# Altium schematic sheet Game_Consol_Top.SchDoc: Game Console Schematic
size A4; CompanyName: University of Melbourne; DrawnBy: 740959; Engineer: Qingyuan Yang; Organization: University of Melbourne; DocumentNumber: 1; Revision: 0.1; SheetNumber: 1; SheetTotal: 10; Title_Project: Game Console
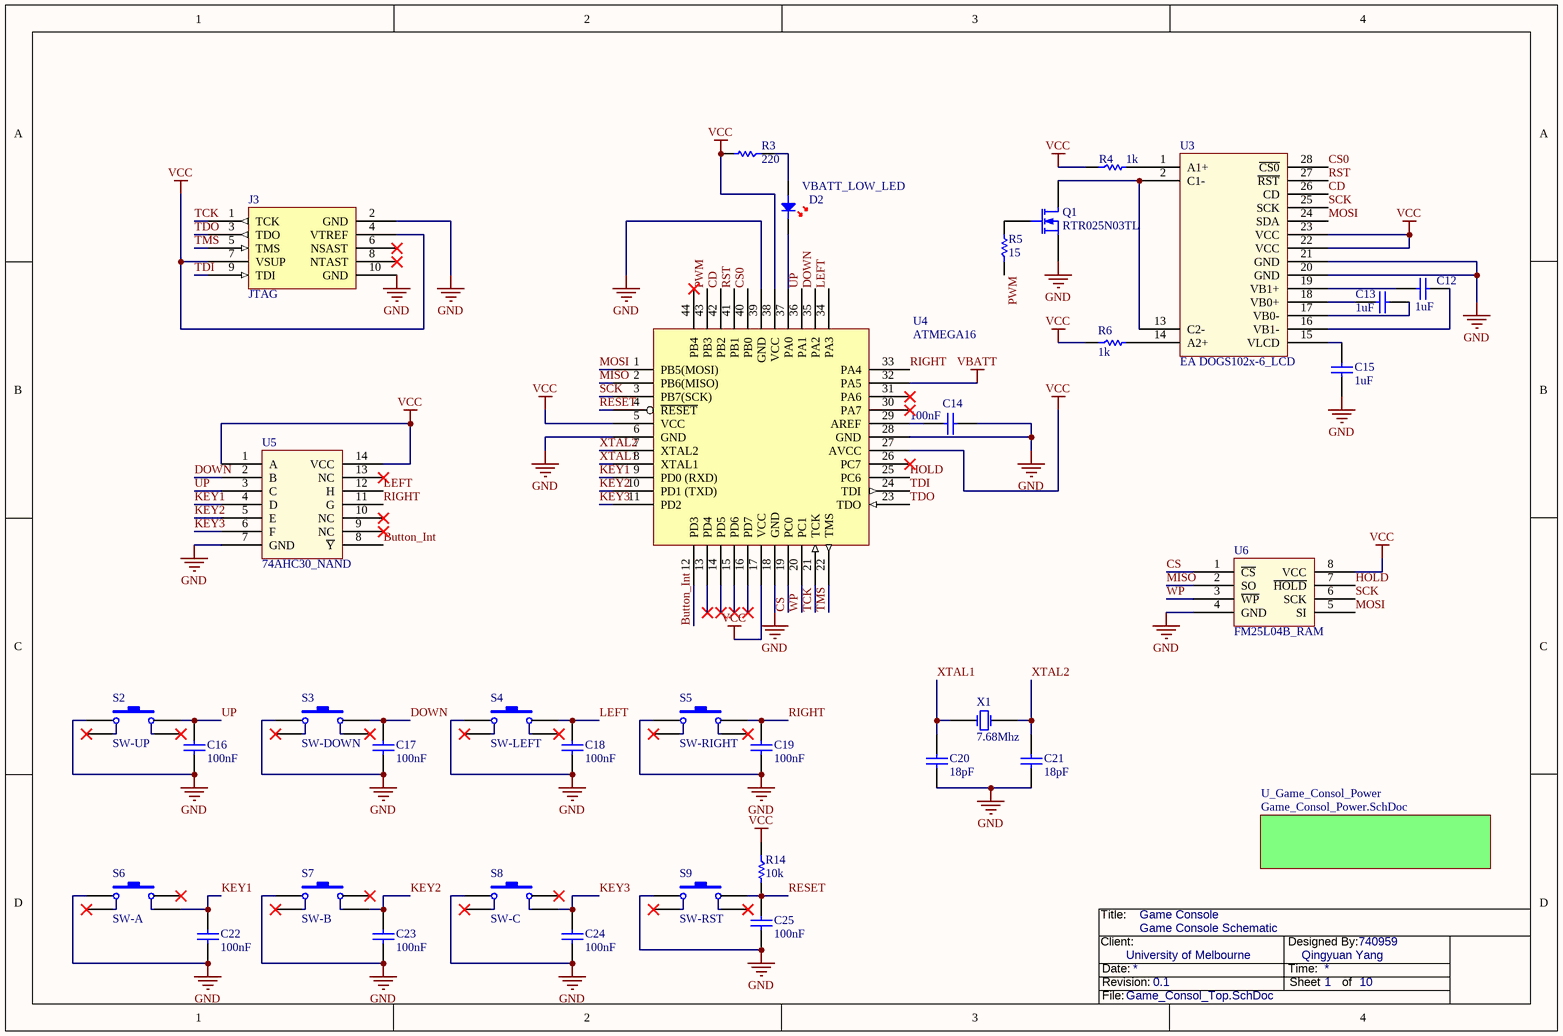
[diagram p0: Game_Consol_Top.SchDoc]

## Parts
C12  1uF  [0805]
C13  1uF  [0805]
C14  100nF  [0805]
C15  1uF  [0805]
C16  100nF  [0805]
C17  100nF  [0805]
C18  100nF  [0805]
C19  100nF  [0805]
C20  18pF  [0805]
C21  18pF  [0805]
C22  100nF  [0805]
C23  100nF  [0805]
C24  100nF  [0805]
C25  100nF  [0805]
D2  VBATT_LOW_LED  [0805D]
J3  JTAG  [BOXEDVERT10]
Q1  RTR025N03TL  [SOT23]
R3  220  [0805]
R4  1k  [0805]
R5  15  [0805]
R6  1k  [0805]
R14  10k  [0805]
S2  SW-UP  [SPNO_SMD]
S3  SW-DOWN  [SPNO_SMD]
S4  SW-LEFT  [SPNO_SMD]
S5  SW-RIGHT  [SPNO_SMD]
S6  SW-A  [SPNO_SMD]
S7  SW-B  [SPNO_SMD]
S8  SW-C  [SPNO_SMD]
S9  SW-RST  [SPNO_SMD]
U3  EA DOGS102x-6_LCD  [EA DOGS102x]
U4  ATMEGA16  [QFP-48]
U5  74AHC30_NAND  [SOIC-14]
U6  FM25L04B_RAM  [SOIC-8]
X1  7.68Mhz  [XTAL_FLAT_SMD]

## Sub-sheets
U_Game_Consol_Power = Game_Consol_Power.SchDoc: no entries

## Nets
GND: C14.1 C15.2 C16.2 C17.2 C18.2 C19.2 C20.2 C21.2 C22.2 C23.2 C24.2 C25.2 J3.2(GND) J3.10(GND) Q1.2 S2.1 S3.1 S4.1 S5.1 S6.1 S7.1 S8.1 S9.1 U3.20(GND) U3.21(GND) U4.6(GND) U4.18(GND) U4.28(GND) U4.39(GND) U5.7(GND) U6.4(GND)
VBATT: U4.32(PA5)
VCC: J3.4(VTREF) J3.7(VSUP) R3.2 R4.1 R6.1 R14.1 U3.22(VCC) U3.23(VCC) U4.5(VCC) U4.17(VCC) U4.27(AVCC) U4.38(VCC) U5.1(A) U5.14(VCC) U6.8(VCC)
Button_Int: U4.12(PD3) U5.8(~{Y})
CD: U3.26(CD) U4.42(PB2)
CS: U4.19(PC0) U6.1(~{CS})
CS0: U3.28(~{CS0}) U4.40(PB0)
DOWN: C17.1 S3.3 U4.35(PA2) U5.2(B)
HOLD: U4.25(PC6) U6.7(~{HOLD})
KEY1: C22.1 S6.4 U4.9(PD0_(RXD)) U5.4(D)
KEY2: C23.1 S7.4 U4.10(PD1_(TXD)) U5.5(E)
KEY3: C24.1 S8.4 U4.11(PD2) U5.6(F)
LEFT: C18.1 S4.3 U4.34(PA3) U5.12(H)
MISO: U4.2(PB6(MISO)) U6.2(SO)
MOSI: U3.24(SDA) U4.1(PB5(MOSI)) U6.5(SI)
PWM: R5.1 U4.43(PB3)
RESET: C25.1 R14.2 S9.3 U4.4(~{RESET})
RIGHT: C19.1 S5.3 U4.33(PA4) U5.11(G)
RST: U3.27(~{RST}) U4.41(PB1)
SCK: U3.25(SCK) U4.3(PB7(SCK)) U6.6(SCK)
TCK: J3.1(TCK) U4.21(TCK)
TDI: J3.9(TDI) U4.24(TDI)
TDO: J3.3(TDO) U4.23(TDO)
TMS: J3.5(TMS) U4.22(TMS)
UP: C16.1 S2.3 U4.36(PA1) U5.3(C)
WP: U4.20(PC1) U6.3(~{WP})
XTAL1: C20.1 U4.8(XTAL1) X1.1(OSC1)
XTAL2: C21.1 U4.7(XTAL2) X1.2(OSC2)
NetC12_1: C12.1 U3.16(VB1-)
NetC12_2: C12.2 U3.19(VB1+)
NetC13_1: C13.1 U3.17(VB0-)
NetC13_2: C13.2 U3.18(VB0+)
NetC14_2: C14.2 U4.29(AREF)
NetC15_1: C15.1 U3.15(VLCD)
NetD2_A: D2.A R3.1
NetD2_K: D2.K U4.37(PA0)
NetQ1_1: Q1.1 R5.2
NetQ1_3: Q1.3 U3.2(C1-) U3.13(C2-)
NetR4_2: R4.2 U3.1(A1+)
NetR6_2: R6.2 U3.14(A2+)

Not connected (* = marked no-connect by the designer): J3 6(NSAST)* 8(NTAST)*; S2 2* 4*; S3 2* 4*; S4 2* 4*; S5 2* 4*; S6 2* 3*; S7 2* 3*; S8 2* 3*; S9 2* 4*; U3 3 4 5 6 7 8 9 10 11 12; U4 13(PD4)* 14(PD5)* 15(PD6)* 16(PD7)* 26(PC7)* 30(PA7)* 31(PA6)* 44(PB4)*; U5 9(NC)* 10(NC)* 13(NC)*

## Notes on the sheet
- Title:
- Client:
- Date:
- Revision:
- Time:
- Designed By:
- Sheet
- of
- File:

## Library data of the parts
C12-C25 = C 0805: Capacitor 100nF; Class I: Passive; Revision: July-2002: Re-released for DXP Platform.
  C12 C13 C15: Value: 1uF
  C14 C16-C19 C22-C25: Value: 100nF
  C20 C21: Value: 18pF
D2 = LED RED: Light Emitting Diode; Manufacturer: Generic Components; Class I: Discrete; Class II: Diode - Switching; Published: 8-Jun-2000; Revision: July-2002: Re-released for DXP Platform.; Publisher: Altium Limited
J3 = JTAG_CON: JTAG ATMEL connector
Q1 = MOSFET-N: N-Channel MOSFET; PackageDocument: 1995/1996; Published: 8-Jun-2000; LatestRevisionDate: 17-Jul-2002; LatestRevisionNote: Re-released for DXP Platform.; PackageReference: E3; Publisher: Altium Limited
R3-R6 R14 = R: Resistor
  R3: Value: 220
  R4 R6: Value: 1k
  R5: Value: 15
  R14: Value: 10k
S2-S9 = SW-PB: Push Button Switch; Manufacturer: TE Connectivity; Manufacturer Part Number: FSM4JSMA; Circuit: SPST-NO; Switch Function: Off-Mom; Contact Rating @ Voltage: 0.05A @ 12VDC; Actuator Type: Standard; Actuator Orientation: Top Actuated; Outline: 6.00mm x 6.00mm; Illumination: Non-Illuminated; Operating Force: 160gf; Published: 24-Mar-1999; LatestRevisionDate: 17-Jul-2002; LatestRevisionNote: Re-released for DXP Platform.; PackageReference: SPST-2; Publisher: Altium Limited; PackageDescription: Switch; 2 Leads; Supplier 1: Digi-Key; RoHS: RoHS Compliant; Category: Switches; Stock 1: 30338; Pricing 1: 1=0.28, 10=0.265, 25=0.2256, 50=0.1974, 100=0.1834, 250=0.1622, 500=0.15516, 1000=0.12694, 5000=0.10579 (AUD); Mounting Type: Surface Mount; Termination Style: Gull Wing; Packaging: Bulk; ComponentLink1URL: http://documents.tycoelectronics.com/commerce/DocumentDelivery/DDEController?Action=srchrtrv&DocNm=2-1437565-7&DocType=CD&DocLang=EN; ComponentLink1Description: http://documents.tycoelectronics.com/commerce/DocumentDelivery/DDEController?Action=srchrtrv&DocNm=2-1437565-7&DocType=CD&DocLang=EN; Supplier Part Number 1: 450-1129-ND
U3 = EA DOGS102x-6: LCD 102x64-pixel with backlight
U4 = ATMEGA16: ATMEGA16 Microcontroller
U5 = 74AHC30: 1 x 8 Input NAND gate
U6 = FM25L04B: FRAM 4Kb Memory
X1 = XTAL: Crystal Oscillator; Revision: July-2002: Re-released for DXP Platform.; Digikey: 535-9103-1-ND